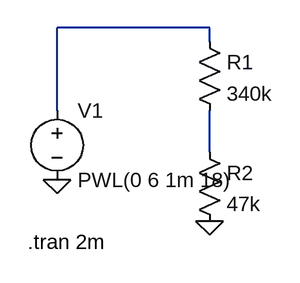
[diagram p0: schematic Draft2.asc]
Draft2.asc, the LTspice schematic file:
Version 4
SHEET 1 880 680
WIRE 304 80 128 80
WIRE 304 96 304 80
WIRE 128 176 128 80
WIRE 304 224 304 176
FLAG 304 304 0
FLAG 128 256 0
SYMBOL voltage 128 160 R0
WINDOW 123 0 0 Left 2
WINDOW 39 0 0 Left 2
SYMATTR InstName V1
SYMATTR Value PWL(0 6 1m 18)
SYMBOL res 288 80 R0
SYMATTR InstName R1
SYMATTR Value 340k
SYMBOL res 288 208 R0
SYMATTR InstName R2
SYMATTR Value 47k
TEXT 94 328 Left 2 !.tran 2m

The netlist it stands for:
* Draft2.asc
V1 N001 0 PWL(0 6 1m 18)
R1 N001 N002 340k
R2 N002 0 47k
.tran 2m
.backanno
.end